# Altium schematic sheet spectrum_1kHz_500Hz.SchDoc
size A4; SheetNumber: 5; SheetTotal: 6
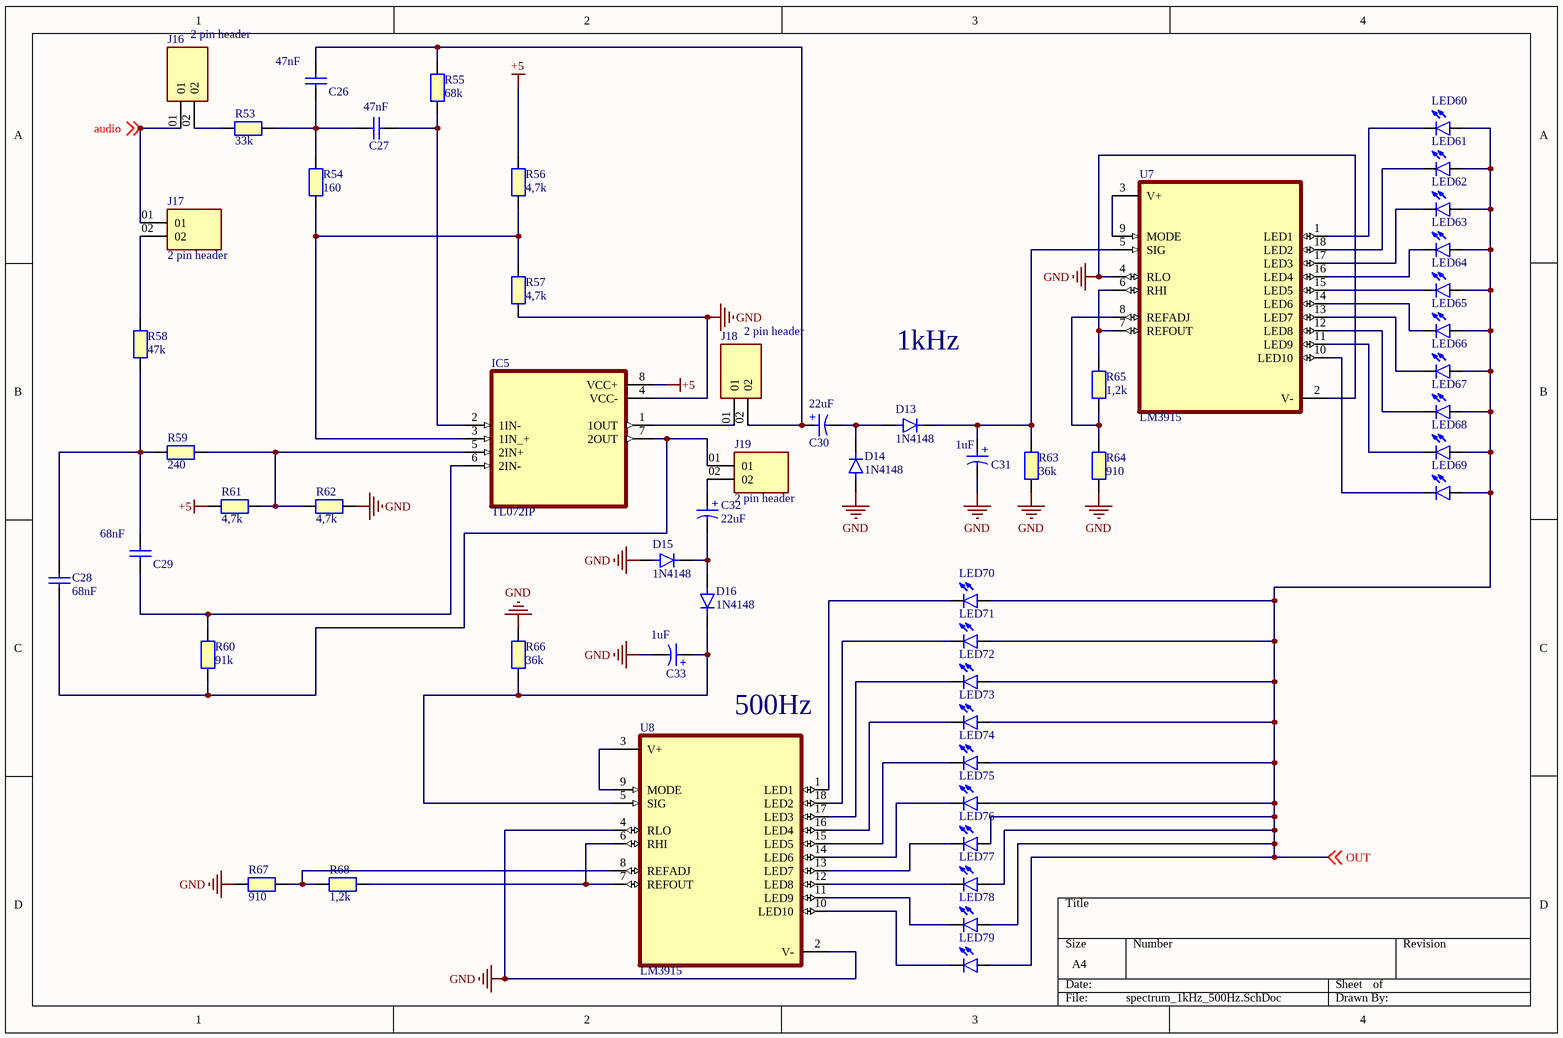
[diagram p0: spectrum_1kHz_500Hz.SchDoc]

## Parts
C26  47nF  [CAPC2012X65N]
C27  47nF  [CAPC2012X65N]
C28  68nF  [CAPC2012X65N]
C29  68nF  [CAPC2012X65N]
C30  22uF  [WCAP-ATG8_D5H11]
C31  1uF  [WCAP-ATG8_D5H11]
C32  22uF  [WCAP-ATG8_D5H11]
C33  1uF  [WCAP-ATG8_D5H11]
D13  1N4148  [DIOAD829W49L456D191]
D14  1N4148  [DIOAD829W49L456D191]
D15  1N4148  [DIOAD829W49L456D191]
D16  1N4148  [DIOAD829W49L456D191]
IC5  TL072IP  [DIP794W45P254L959H508Q8]
J16  2 pin header  [SAMTEC_HTSW-102-07-TM-S]
J17  2 pin header  [SAMTEC_HTSW-102-07-TM-S]
J18  2 pin header  [SAMTEC_HTSW-102-07-TM-S]
J19  2 pin header  [SAMTEC_HTSW-102-07-TM-S]
LED60  LED 2x3x4  [LED 2x3x4mm]  (value not drawn)
LED61  LED 2x3x4  [LED 2x3x4mm]  (value not drawn)
LED62  LED 2x3x4  [LED 2x3x4mm]  (value not drawn)
LED63  LED 2x3x4  [LED 2x3x4mm]  (value not drawn)
LED64  LED 2x3x4  [LED 2x3x4mm]  (value not drawn)
LED65  LED 2x3x4  [LED 2x3x4mm]  (value not drawn)
LED66  LED 2x3x4  [LED 2x3x4mm]  (value not drawn)
LED67  LED 2x3x4  [LED 2x3x4mm]  (value not drawn)
LED68  LED 2x3x4  [LED 2x3x4mm]  (value not drawn)
LED69  LED 2x3x4  [LED 2x3x4mm]  (value not drawn)
LED70  LED 2x3x4  [LED 2x3x4mm]  (value not drawn)
LED71  LED 2x3x4  [LED 2x3x4mm]  (value not drawn)
LED72  LED 2x3x4  [LED 2x3x4mm]  (value not drawn)
LED73  LED 2x3x4  [LED 2x3x4mm]  (value not drawn)
LED74  LED 2x3x4  [LED 2x3x4mm]  (value not drawn)
LED75  LED 2x3x4  [LED 2x3x4mm]  (value not drawn)
LED76  LED 2x3x4  [LED 2x3x4mm]  (value not drawn)
LED77  LED 2x3x4  [LED 2x3x4mm]  (value not drawn)
LED78  LED 2x3x4  [LED 2x3x4mm]  (value not drawn)
LED79  LED 2x3x4  [LED 2x3x4mm]  (value not drawn)
R53  33k  [RESC2012X50N]
R54  160  [RESC2012X50N]
R55  68k  [RESC2012X50N]
R56  4,7k  [RESC2012X50N]
R57  4,7k  [RESC2012X50N]
R58  47k  [RESC2012X50N]
R59  240  [RESC2012X50N]
R60  91k  [RESC2012X50N]
R61  4,7k  [RESC2012X50N]
R62  4,7k  [RESC2012X50N]
R63  36k  [RESC2012X50N]
R64  910  [RESC2012X50N]
R65  1,2k  [RESC2012X50N]
R66  36k  [RESC2012X50N]
R67  910  [RESC2012X50N]
R68  1,2k  [RESC2012X50N]
U7  LM3915  [DIP952W45P254L2336H533Q18]
U8  LM3915  [DIP952W45P254L2336H533Q18]

## Nets
+5: IC5.8(VCC+) R56.2 R61.2
GND: C31.2(N) C33.2(N) D14.A D15.A IC5.4(VCC-) R57.1 R62.2 R63.1 R64.2 R66.1 R67.2 U7.2(V-) U7.4(RLO) U8.2(V-) U8.4(RLO)
audio: J16.01 J17.01 ; off-sheet audio
OUT: LED60.A LED61.A LED62.A LED63.A LED64.A LED65.A LED66.A LED67.A LED68.A LED69.A LED70.A LED71.A LED72.A LED73.A LED74.A LED75.A LED76.A LED77.A LED78.A LED79.A ; off-sheet OUT
NetC26_1: C26.1 C27.1 R53.2 R54.2
NetC26_2: C26.2 C30.1(P) J18.02 R55.2
NetC27_2: C27.2 IC5.2(1IN-) R55.1
NetC28_1: C28.1 IC5.7(2OUT) J19.01 R60.1
NetC28_2: C28.2 C29.2 R58.1 R59.2
NetC29_1: C29.1 IC5.6(2IN-) R60.2
NetC30_2: C30.2(N) D13.A D14.C
NetC31_1: C31.1(P) D13.C R63.2 U7.5(SIG)
NetC32_1: C32.1(P) J19.02
NetC32_2: C32.2(N) D15.C D16.A
NetC33_1: C33.1(P) D16.C R66.2 U8.5(SIG)
NetIC5_1: IC5.1(1OUT) J18.01
NetIC5_3: IC5.3(1IN_+) R54.1 R56.1 R57.2
NetIC5_5: IC5.5(2IN+) R59.1 R61.1 R62.1
NetJ16_02: J16.02 R53.1
NetJ17_02: J17.02 R58.2
NetLED60_K: LED60.K(C) U7.1(LED1)
NetLED61_K: LED61.K(C) U7.18(LED2)
NetLED62_K: LED62.K(C) U7.17(LED3)
NetLED63_K: LED63.K(C) U7.16(LED4)
NetLED64_K: LED64.K(C) U7.15(LED5)
NetLED65_K: LED65.K(C) U7.14(LED6)
NetLED66_K: LED66.K(C) U7.13(LED7)
NetLED67_K: LED67.K(C) U7.12(LED8)
NetLED68_K: LED68.K(C) U7.11(LED9)
NetLED69_K: LED69.K(C) U7.10(LED10)
NetLED70_K: LED70.K(C) U8.1(LED1)
NetLED71_K: LED71.K(C) U8.18(LED2)
NetLED72_K: LED72.K(C) U8.17(LED3)
NetLED73_K: LED73.K(C) U8.16(LED4)
NetLED74_K: LED74.K(C) U8.15(LED5)
NetLED75_K: LED75.K(C) U8.14(LED6)
NetLED76_K: LED76.K(C) U8.13(LED7)
NetLED77_K: LED77.K(C) U8.12(LED8)
NetLED78_K: LED78.K(C) U8.11(LED9)
NetLED79_K: LED79.K(C) U8.10(LED10)
NetR64_1: R64.1 R65.2 U7.8(REFADJ)
NetR65_1: R65.1 U7.6(RHI) U7.7(REFOUT)
NetR67_1: R67.1 R68.2 U8.8(REFADJ)
NetR68_1: R68.1 U8.6(RHI) U8.7(REFOUT)
NetU7_3: U7.3(V+) U7.9(MODE)
NetU8_3: U8.3(V+) U8.9(MODE)

## Notes on the sheet
- 1kHz
- (near U8) 500Hz
- (in symbol 860010272005) +

## Library data of the parts
C26 C27 = 885012004008: 47nF ceramic; Manufacturer: Wurth Elektronik; Match Code: WCAP-CSGP; Case/Size Code: 0201; Capacitance: 22pF; Capacitance Tolerance: +/-5%; Ceramic Type: NP0 Class I; Insulation Resistance: 10GΩ; Q Factor: 840; Rated Voltage (DC): 25V; Technical Reference: NP00201220J025DFCT10000; Manufacturer Part Number: 885012004008; Category: Multilayer Ceramic Chip Capacitors; ComponentLink1Description: Website Link; ComponentLink1URL: https://www.we-online.com/redexpert/article/885012004008?ad; ComponentLink2Description: Datasheet Link; ComponentLink2URL: https://www.we-online.com/redexpert/spec/885012004008?ad; Mount: Surface Mount; Operating Temperature Max: 125°C; Operating Temperature Min: -55°C; Packaging: Tape and Reel; Length: 0.6mm; Width: 0.3mm; Height: 0.3mm
C28 C29 = 885012004008: 68nF ceramic; Manufacturer: Wurth Elektronik; Match Code: WCAP-CSGP; Case/Size Code: 0201; Capacitance: 22pF; Capacitance Tolerance: +/-5%; Ceramic Type: NP0 Class I; Insulation Resistance: 10GΩ; Q Factor: 840; Rated Voltage (DC): 25V; Technical Reference: NP00201220J025DFCT10000; Manufacturer Part Number: 885012004008; Category: Multilayer Ceramic Chip Capacitors; ComponentLink1Description: Website Link; ComponentLink1URL: https://www.we-online.com/redexpert/article/885012004008?ad; ComponentLink2Description: Datasheet Link; ComponentLink2URL: https://www.we-online.com/redexpert/spec/885012004008?ad; Mount: Surface Mount; Operating Temperature Max: 125°C; Operating Temperature Min: -55°C; Packaging: Tape and Reel; Length: 0.6mm; Width: 0.3mm; Height: 0.3mm
C30 C32 = 860010272005: Elco 22uF; Manufacturer: Wurth Elektronik; Match Code: WCAP-ATG8; Capacitance: 100µF; Capacitance Tolerance: +/-20%; Dissipation Factor: 19%; Endurance: 2000h; Leakage Current: 10µA; Rated Voltage (DC): 10V; Ripple Current: 198mA; Technical Reference: ATBC110101M010DSPA3B000; Manufacturer Part Number: 860010272005; Category: Aluminum Electrolytic Capacitors; ComponentLink1Description: Website Link; ComponentLink1URL: https://www.we-online.com/redexpert/article/860010272005?ad; ComponentLink2Description: Datasheet Link; ComponentLink2URL: https://www.we-online.com/redexpert/spec/860010272005?ad; Mount: Through Hole; Operating Temperature Max: 85°C; Operating Temperature Min: -40°C; Packaging: Ammo Pack; Height: 11mm; Diameter: 5mm
C31 = 860010272005: WCAP-ATG8 Aluminum Electrolytic Capacitor, Radial, THT, D5 x H11mm, 1uF, 10V; Manufacturer: Wurth Elektronik; Capacitance: 100µF; Capacitance Tolerance: +/-20%; Dissipation Factor: 19%; Endurance: 2000h; Leakage Current: 10µA; Ripple Current: 198mA; Technical Reference: ATBC110101M010DSPA3B000; Manufacturer Part Number: 860010272005; Category: Aluminum Electrolytic Capacitors; Match Code: WCAP-ATG8; ComponentLink1Description: Website Link; ComponentLink1URL: https://www.we-online.com/redexpert/article/860010272005?ad; ComponentLink2Description: Datasheet Link; ComponentLink2URL: https://www.we-online.com/redexpert/spec/860010272005?ad; Mount: Through Hole; Operating Temperature Max: 85°C; Operating Temperature Min: -40°C; Packaging: Ammo Pack; Height: 11mm; Diameter: 5mm; Rated Voltage (DC): 10V
C33 = 860010272005: WCAP-ATG8 Aluminum Electrolytic Capacitor, Radial, THT, D5 x H11mm, 1µF, 10V; Manufacturer: Wurth Elektronik; Capacitance: 100µF; Capacitance Tolerance: +/-20%; Dissipation Factor: 19%; Endurance: 2000h; Leakage Current: 10µA; Ripple Current: 198mA; Technical Reference: ATBC110101M010DSPA3B000; Manufacturer Part Number: 860010272005; Category: Aluminum Electrolytic Capacitors; Match Code: WCAP-ATG8; ComponentLink1Description: Website Link; ComponentLink1URL: https://www.we-online.com/redexpert/article/860010272005?ad; ComponentLink2Description: Datasheet Link; ComponentLink2URL: https://www.we-online.com/redexpert/spec/860010272005?ad; Mount: Through Hole; Operating Temperature Max: 85°C; Operating Temperature Min: -40°C; Packaging: Ammo Pack; Height: 11mm; Diameter: 5mm; Rated Voltage (DC): 10V
D13-D16 = 1N4148: Diode Standard 75V 200mA Surface Mount SOD-523F; MF: ON Semiconductor; Price: None; Availability: In Stock; Package: AXIAL LEAD-2 ON Semiconductor; MP: 1N4148; Value: *; SnapEDA_Link: https://www.snapeda.com/parts/1N4148/Onsemi/view-part/?ref=snap; Purchase-URL: https://pricing.snapeda.com/search/part/1N4148/?ref=eda; Check_prices: https://www.snapeda.com/parts/1N4148/Onsemi/view-part/?ref=eda
IC5 = TL072IP: Dual, 30-V, 3-MHz, high slew rate (13-V/Âµs), In to V+, JFET-input op amp; MF: Texas Instruments; Price: None; Package: PDIP-8 Texas; Purchase-URL: https://pricing.snapeda.com/search/part/TL072IP/?ref=eda; Availability: In Stock; SnapEDA_Link: https://www.snapeda.com/parts/TL072IP/Texas+Instruments/view-part/?ref=snap; Value: *; MP: TL072IP; Check_prices: https://www.snapeda.com/parts/TL072IP/Texas+Instruments/view-part/?ref=eda
J16-J19 = 2 pin header: 2 pin header Jumper; MP: HTSW10207TMS; MF: Samtec; SnapEDA_Link: https://www.snapeda.com/parts/HTSW10207TMS/Samtec/view-part/?ref=snap; Value: *; Purchase-URL: https://pricing.snapeda.com/search/part/HTSW10207TMS/?ref=eda; Availability: In Stock; Check_prices: https://www.snapeda.com/parts/HTSW10207TMS/Samtec/view-part/?ref=eda; Package: None; Price: None
LED60-LED79 = LED 2x3x4: Green 569nm LED Indication - Discrete 1.9V Radial; MP: TLLG4400; MF: Vishay Semiconductors; SnapEDA_Link: https://www.snapeda.com/parts/TLLG4400/Vishay/view-part/?ref=snap; Availability: In Stock; Package: None; Check_prices: https://www.snapeda.com/parts/TLLG4400/Vishay/view-part/?ref=eda; Value: *; Purchase-URL: https://pricing.snapeda.com/search/part/TLLG4400/?ref=eda; Price: None
R53 = RESISTOR 0805: 33k Resistor 0805; Part Number: TNPW080510K0BETA; Manufacturer: Vishay Dale
R54 = RESISTOR 0805: 160Ohm Resistor 0805; Part Number: TNPW080510K0BETA; Manufacturer: Vishay Dale
R55 = RESISTOR 0805: 68k Resistor 0805; Part Number: TNPW080510K0BETA; Manufacturer: Vishay Dale
R56 R57 R61 R62 R66 = RESISTOR 0805: 4,7k Resistor 0805; Part Number: TNPW080510K0BETA; Manufacturer: Vishay Dale
R58 = RESISTOR 0805: 47k Resistor 0805; Part Number: TNPW080510K0BETA; Manufacturer: Vishay Dale
R59 = RESISTOR 0805: 240 resistor 0805; Part Number: TNPW080510K0BETA; Manufacturer: Vishay Dale
R60 = RESISTOR 0805: 91k Resistor 0805; Part Number: TNPW080510K0BETA; Manufacturer: Vishay Dale
R63 = RESISTOR 0805: 36k Resistor 0805; Part Number: TNPW080510K0BETA; Manufacturer: Vishay Dale
R64 R67 = RESISTOR 0805: 910 Resistor 0805; Part Number: TNPW080510K0BETA; Manufacturer: Vishay Dale
R65 R68 = RESISTOR 0805: 1,2k Resistor 0805; Part Number: TNPW080510K0BETA; Manufacturer: Vishay Dale
U7 U8 = LM3915: MP: LM3914N-1; Package: None; Availability: Unavailable; Price: None; Value: *